# Altium schematic sheet 200_CDH_USB_2_Hub.SchDoc
size A; Author: Tyler Sengia; Organization: SSPL; Revision: 1; SheetNumber: 1
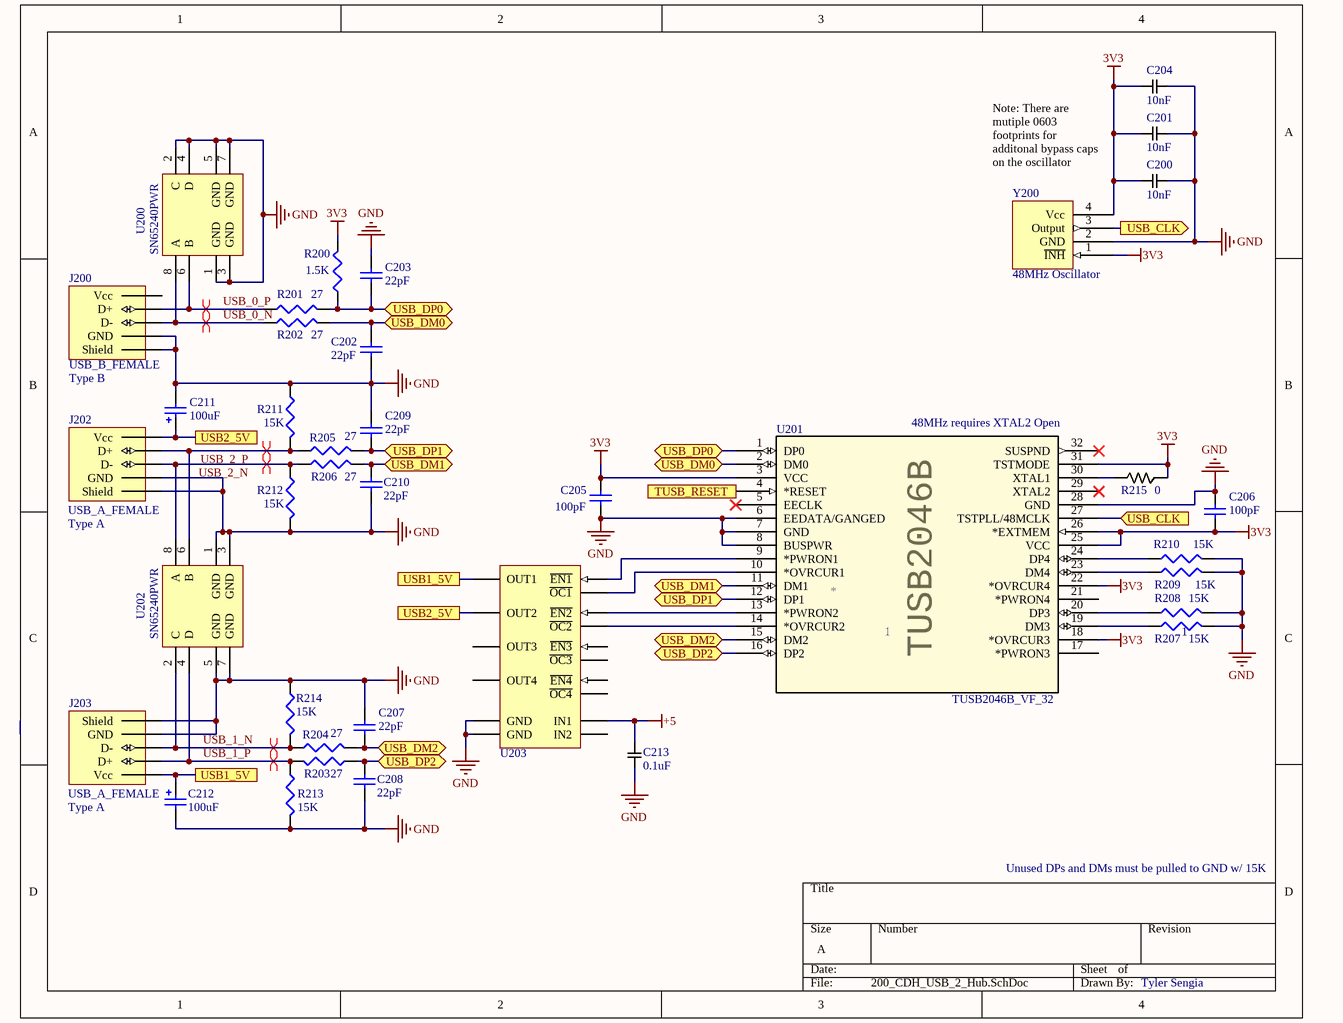
[diagram p0: 200_CDH_USB_2_Hub.SchDoc]

## Parts
C200  value 10nF  [IMPERIAL0603_Capacitor]  (hidden comment: 10nF Capacitor)
C201  value 10nF  [IMPERIAL0603_Capacitor]  (hidden comment: 10nF Capacitor)
C202  value 22pF  [IMPERIAL0805_CAPACITOR]  (hidden comment: 22pF capacitor)
C203  value 22pF  [IMPERIAL0805_CAPACITOR]  (hidden comment: 22pF capacitor)
C204  value 10nF  [IMPERIAL0603_Capacitor]  (hidden comment: 10nF Capacitor)
C205  value 100pF  [IMPERIAL0603_Capacitor]  (hidden comment: 100pF Capacitor)
C206  value 100pF  [IMPERIAL0603_Capacitor]  (hidden comment: 100pF Capacitor)
C207  value 22pF  [IMPERIAL0805_CAPACITOR]  (hidden comment: 22pF capacitor)
C208  value 22pF  [IMPERIAL0805_CAPACITOR]  (hidden comment: 22pF capacitor)
C209  value 22pF  [IMPERIAL0805_CAPACITOR]  (hidden comment: 22pF capacitor)
C210  value 22pF  [IMPERIAL0805_CAPACITOR]  (hidden comment: 22pF capacitor)
C211  value 100uF  [POLAR_CAP_SMD_EIA2010]  (hidden comment: F910J107MBAAJ6)
C212  value 100uF  [POLAR_CAP_SMD_EIA2010]  (hidden comment: F910J107MBAAJ6)
C213  value 0.1uF  [IMPERIAL0603_Capacitor]  (hidden comment: 0.1uF Capacitor)
J200  USB_B_FEMALE  USB Type: Type B  [USB_B_FEMALE_RT]
J202  USB_A_FEMALE  USB Type: Type A  [USB_A_FEMALE_SINGLE]
J203  USB_A_FEMALE  USB Type: Type A  [USB_A_FEMALE_SINGLE]
R200  value 1.5K  [Imperial0603_RES]  (hidden comment: 1.5KOhm Resistor)
R201  value 27  [Imperial0805_RES]  (hidden comment: 27 Ohm Resistor)
R202  value 27  [Imperial0805_RES]  (hidden comment: 27 Ohm Resistor)
R203  value 27  [Imperial0805_RES]  (hidden comment: 27 Ohm Resistor)
R204  value 27  [Imperial0805_RES]  (hidden comment: 27 Ohm Resistor)
R205  value 27  [Imperial0805_RES]  (hidden comment: 27 Ohm Resistor)
R206  value 27  [Imperial0805_RES]  (hidden comment: 27 Ohm Resistor)
R207  value 15K  [Imperial0603_RES]  (hidden comment: 15KOhm Resistor)
R208  value 15K  [Imperial0603_RES]  (hidden comment: 15KOhm Resistor)
R209  value 15K  [Imperial0603_RES]  (hidden comment: 15KOhm Resistor)
R210  value 15K  [Imperial0603_RES]  (hidden comment: 15KOhm Resistor)
R211  value 15K  [Imperial0603_RES]  (hidden comment: 15KOhm Resistor)
R212  value 15K  [Imperial0603_RES]  (hidden comment: 15KOhm Resistor)
R213  value 15K  [Imperial0603_RES]  (hidden comment: 15KOhm Resistor)
R214  value 15K  [Imperial0603_RES]  (hidden comment: 15KOhm Resistor)
R215  value 0  [Imperial0603_RES]  (hidden comment: 0 Ohm Link)
U200  SN65240PWR  [PW0008A_M]
U201  TUSB2046B_VF_32  GENERIC_PART_NUMBER: TUSB2046B  [TQFP80P900X900X160-32N]
U202  SN65240PWR  [PW0008A_M]
U203  TPS2044BDR  [D0016A_M_Local]  (value not drawn)
Y200  48MHz Oscillator  [KC3225-C3]

## Ports
TUSB_RESET (in), USB1_5V, USB2_5V, USB_CLK (in), USB_CLK (out), USB_DM0 (bidir), USB_DM1 (bidir), USB_DM2 (bidir), USB_DP0 (bidir), USB_DP1 (bidir), USB_DP2 (bidir)

## Nets
3V3: C200.2 C201.2 C204.2 C205.2 C206.1 R200.2 R215.2 U201.3(VCC) U201.18(*OVRCUR3) U201.22(*OVRCUR4) U201.25(VCC) U201.26(*EXTMEM) U201.31(TSTMODE) Y200.1(~{INH}) Y200.4(Vcc)
+5: C213.2 U203.2(IN1)
GND: C200.1 C201.1 C202.1 C203.2 C204.1 C205.1 C206.2 C207.1 C208.2 C209.1 C210.2 C211.2 C212.2 C213.1 J200.GND J200.Shield J202.GND J202.Shield J203.GND J203.Shield R207.2 R208.2 R209.2 R210.2 R211.1 R212.2 R213.1 R214.2 U200.1(GND) U200.2(C) U200.3(GND) U200.4(D) U200.5(GND) U200.7(GND) U201.6(EEDATA/GANGED) U201.7(GND) U201.8(BUSPWR) U201.28(GND) U202.1(GND) U202.3(GND) U202.5(GND) U202.7(GND) U203.1(GND) U203.5(GND) Y200.2(GND)
TUSB_RESET: U201.4(*RESET) ; port TUSB_RESET
USB1_5V: C212.1 J203.Vcc U203.15(OUT1) ; port USB1_5V
USB2_5V: C211.1 J202.Vcc U203.14(OUT2) ; port USB2_5V
USB_0_N: J200.D- R202.1 U200.8(A)
USB_0_P: J200.D+ R201.1 U200.6(B)
USB_1_N: J203.D- R204.2 R214.1 U202.2(C)
USB_1_P: J203.D+ R203.1 R213.2 U202.4(D)
USB_2_N: J202.D- R206.1 R212.1 U202.8(A)
USB_2_P: J202.D+ R205.1 R211.2 U202.6(B)
USB_CLK: U201.27(TSTPLL/48MCLK) Y200.3(Output) ; port USB_CLK
USB_DM0: C202.2 R202.2 U201.2(DM0) ; port USB_DM0
USB_DM1: C210.1 R206.2 U201.11(DM1) ; port USB_DM1
USB_DM2: C207.2 R204.1 U201.15(DM2) ; port USB_DM2
USB_DP0: C203.1 R200.1 R201.2 U201.1(DP0) ; port USB_DP0
USB_DP1: C209.2 R205.2 U201.12(DP1) ; port USB_DP1
USB_DP2: C208.1 R203.2 U201.16(DP2) ; port USB_DP2
NetR207_1: R207.1 U201.19(DM3)
NetR208_1: R208.1 U201.20(DP3)
NetR209_1: R209.1 U201.23(DM4)
NetR210_1: R210.1 U201.24(DP4)
NetR215_1: R215.1 U201.30(XTAL1)
NetU201_9: U201.9(*PWRON1) U203.3(~{EN1})
NetU201_10: U201.10(*OVRCUR1) U203.16(~{OC1})
NetU201_13: U201.13(*PWRON2) U203.4(~{EN2})
NetU201_14: U201.14(*OVRCUR2) U203.13(~{OC2})

Not connected (* = marked no-connect by the designer): J200 Vcc; U201 5(EECLK)* 17(*PWRON3) 21(*PWRON4) 29(XTAL2)* 32(SUSPND)*; U203 6(IN2) 7(~{EN3}) 8(~{EN4}) 9(~{OC4}) 10(OUT4) 11(OUT3) 12(~{OC3})

## Layout directives
differential pair; rule Impedance Constraint [Min = 81.00    Max = 99.00    ]: USB_0_N, USB_0_P, USB_1_N, USB_1_P, USB_2_N, USB_2_P

## Notes on the sheet
- Note: There are mutiple 0603 footprints for additonal bypass caps on the oscillator
- (near U201) 48MHz requires XTAL2 Open
- Unused DPs and DMs must be pulled to GND w/ 15K

## Library data of the parts
C200 C201 C204 = 06033C103J4Z2A: 10nF Capacitor for crystal oscillator; Manufacturer: AVX; Supplier Part Number: 581-06033C103J4Z2A; Supplier: Mouser; Manufacturer Part Number: 06033C103J4Z2A
C202 C203 C207-C210 = C0805X220K3GACAUTO: 22pF USB Filter Capacitor; Published: 8-Jun-2000; LatestRevisionDate: 29-May-2009; LatestRevisionNote: IPC-7351 Footprint Added.; PackageReference: C1206; Publisher: Altium Limited; PackageDescription: Chip Capacitor; Supplier 1: Digi-Key; Supplier Part Number 1: 399-19450-1-ND
C205 C206 = C0603C101K8HAUTO: 100pF Cap for IC Vcc Smoothing; Published: 8-Jun-2000; LatestRevisionDate: 29-May-2009; LatestRevisionNote: IPC-7351 Footprint Added.; PackageReference: C1206; Publisher: Altium Limited; PackageDescription: Chip Capacitor; Supplier 1: Mouser; Supplier Part Number 1: 80-C0603C101K8HAUTO
C211 C212 = F910J107MBAAJ6: 100uF, USB Power smoothing capacitor, tantalium, low ESR; Published: 8-Jun-2000; LatestRevisionDate: 29-May-2009; LatestRevisionNote: IPC-7351 Footprint Added.; PackageReference: C0805; Publisher: Altium Limited; PackageDescription: Chip Capacitor; Supplier 1: Digi-Key; Supplier Part Number 1: 478-12526-1-ND
C213 = VJ0603Y104MXQPW1BC: 0.1uF Capacitor, Non Polarized Chip Cap; Supplier 1: Mouser; Supplier Part Number 1: 963-LMK107BJ225KK-T
J200 = USB_B_FEMALE: USB Type B female connector.; Supplier 1: Digi-Key; Supplier Part Number 1: 380-1492-ND
J202 J203 = USB_A_FEMALE: USB Type A female connector.; Supplier 1: Digi-Key; Supplier Part Number 1: 732-10012-ND
R200 = ERJ-S03D1501V: 1.5KOhm Resistor, for USB pull up; Published: 8-Jun-2000; LatestRevisionDate: 29-May-2009; LatestRevisionNote: IPC-7351 Footprint Added.; PackageReference: J1-0603; Publisher: Altium Limited; PackageDescription: Chip Resistor; Supplier 1: Mouser; Supplier Part Number 1: 667-ERJ-S03D1501V
R201-R206 = CR0805-FX-27R0ELF: 27Ohm Resitor, USB Terminating Resistor; Published: 8-Jun-2000; LatestRevisionDate: 29-May-2009; LatestRevisionNote: IPC-7351 Footprint Added.; PackageReference: J1-0603; Publisher: Altium Limited; PackageDescription: Chip Resistor; Supplier 1: Mouser; Supplier Part Number 1: 652-CR0805FX-27R0ELF
R207-R214 = CRCW060315K0JNEAC: 15KOhm Resistor, for USB pull down; Published: 8-Jun-2000; LatestRevisionDate: 29-May-2009; LatestRevisionNote: IPC-7351 Footprint Added.; PackageReference: J1-0603; Publisher: Altium Limited; PackageDescription: Chip Resistor; Supplier 1: Digi-Key; Supplier Part Number 1: 541-15KGCT-ND
R215 = 0_Ohm_Link: Placeholder 0 Ohm Link.
U200 U202 = CMP-0326-00072-3: Universal Serial Bus Port Transient Suppressor, 4 Channels, -40 to +85 degC, 8-pin TSSOP (PW), Green (RoHS & no Sb/Br); Manufacturer: Texas Instruments; IO Capacitance(Typ)(pF): 35; Breakdown Voltage(Min)(V): 7; USB Full Speed: TRUE; SubFamily: ESD Solution; Eco-Plan: Pb-Free (RoHS); IO Leakage Current(nA): 1000; Mounting Technology: Surface Mount; ComponentLink3Description: URL Link1; PackageDescription: 8-Pin Plastic Thin Small Outline Package 3 x 4.4 mm Body ,0.65 mm Pitch; DatasheetVersion: SLLS266G; PackageVersion: revG, Feb-2011; ComponentLink2URL: http://www.ti.com/general/docs/lit/getliterature.tsp?genericPartNumber=SN65240&fileType=pdf; ComponentLink2Description: Datasheet; ComponentLink1URL: http://www.ti.com/; ComponentLink3URL: SamplesURL:http://www.ti.com/product/sn65240#samples; PackageReference: PW0008A; ComponentLink1Description: Manufacturer URL; PartNumber: SN65240PWR; Manufacturer Part Number: SN65240PWR
U201 = TUSB2046B_VF_32: USB 2.0 Hub IC; Vendor: Texas Instruments; PACKAGE_DESIGNATOR: VF; PIN_COUNT: 32; FAMILY_NAME: USB HUB CONTROLLER; INDUSTRY_STD_PKG_TYPE: LQFP; Manufacturer_Part_Number: tusb2046b_vf_32; Manufacturer: Texas Instruments; Datasheet_URL: http://www.ti.com/lit/gpn/TUSB2046B; Value: Value; Type: Type; RefDes: RefDes; Supplier 1: Digi-Key; Supplier Part Number 1: 296-48218-1-ND
U203 = TITPS10244BD1: Quad Current-Limited Power Distribution Switch, 1 A Current Limit, -40 to 85 degC, 16-pin SOIC (D), Green (RoHS & no Sb/Br); Manufacturer: Texas Instruments; ComponentLink1Description: datasheet; ComponentLink1URL: http://www.ti.com/general/docs/lit/getliterature.tsp?genericPartNumber=TPS2044B&fileType=pdf
Y200 = KC3225A-C3: 48MHz crystal oscillator